# Altium schematic sheet filter.SchDoc
size A
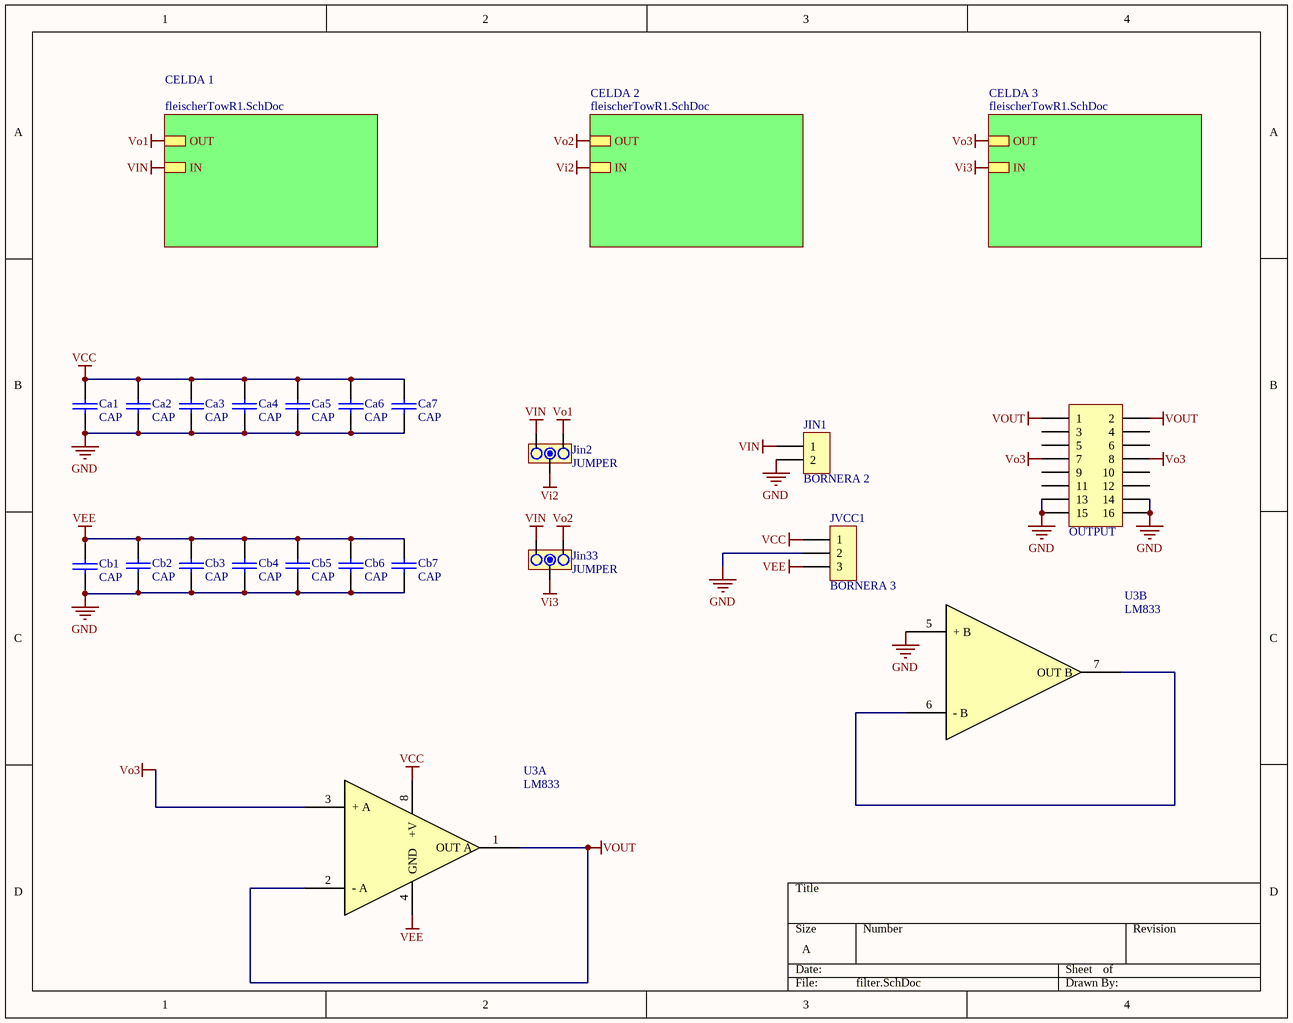
[diagram p0: filter.SchDoc]

## Parts
?  OUTPUT  [SIP8*2]
Ca1  CAP  [CAP200]
Ca2  CAP  [CAP200]
Ca3  CAP  [CAP200]
Ca4  CAP  [CAP200]
Ca5  CAP  [CAP200]
Ca6  CAP  [CAP200]
Ca7  CAP  [CAP200]
Cb1  CAP  [CAP200]
Cb2  CAP  [CAP200]
Cb3  CAP  [CAP200]
Cb4  CAP  [CAP200]
Cb5  CAP  [CAP200]
Cb6  CAP  [CAP200]
Cb7  CAP  [CAP200]
JIN1  BORNERA 2  [BORNERA2]
Jin2  JUMPER  [JUMPER3TH]
Jin33  JUMPER  [JUMPER3TH]
JVCC1  BORNERA 3  [BORNERA3]
U3  LM833  [DIP8]  (parts A,B of 2)

## Sub-sheets
CELDA 1 = fleischerTowR1.SchDoc: OUT, IN
CELDA 2 = fleischerTowR1.SchDoc: OUT, IN
CELDA 3 = fleischerTowR1.SchDoc: OUT, IN

## Nets
GND: ?.13 ?.14 ?.15 ?.16 Ca1.2 Ca2.2 Ca3.2 Ca4.2 Ca5.2 Ca6.2 Ca7.2 Cb1.2 Cb2.2 Cb3.2 Cb4.2 Cb5.2 Cb6.2 Cb7.2 JIN1.2 JVCC1.2 U3.5(+_B)
VCC: Ca1.1 Ca2.1 Ca3.1 Ca4.1 Ca5.1 Ca6.1 Ca7.1 JVCC1.1 U3.8(+V)
VEE: Cb1.1 Cb2.1 Cb3.1 Cb4.1 Cb5.1 Cb6.1 Cb7.1 JVCC1.3 U3.4(GND)
Vi2: Jin2.2 ; sheet CELDA 2/IN
Vi3: Jin33.2 ; sheet CELDA 3/IN
VIN: JIN1.1 Jin2.1 Jin33.1 ; sheet CELDA 1/IN
Vo1: Jin2.3 ; sheet CELDA 1/OUT
Vo2: Jin33.3 ; sheet CELDA 2/OUT
Vo3: ?.7 ?.8 U3.3(+_A) ; sheet CELDA 3/OUT
VOUT: ?.1 ?.2 U3.1(OUT_A) U3.2(-_A)
NetU3_6: U3.6(-_B) U3.7(OUT_B)

Not connected (* = marked no-connect by the designer): ? 3 4 5 6 9 10 11 12

## Library data of the parts
? = CON8*2
Jin2 Jin33 = JUMPER3TH: TIRA DE PINES 1x3
U3 = LM833: Dual Audio Operational Amplifier